# EAGLE design Argo2_Tracker (EAGLE 7.5.0)
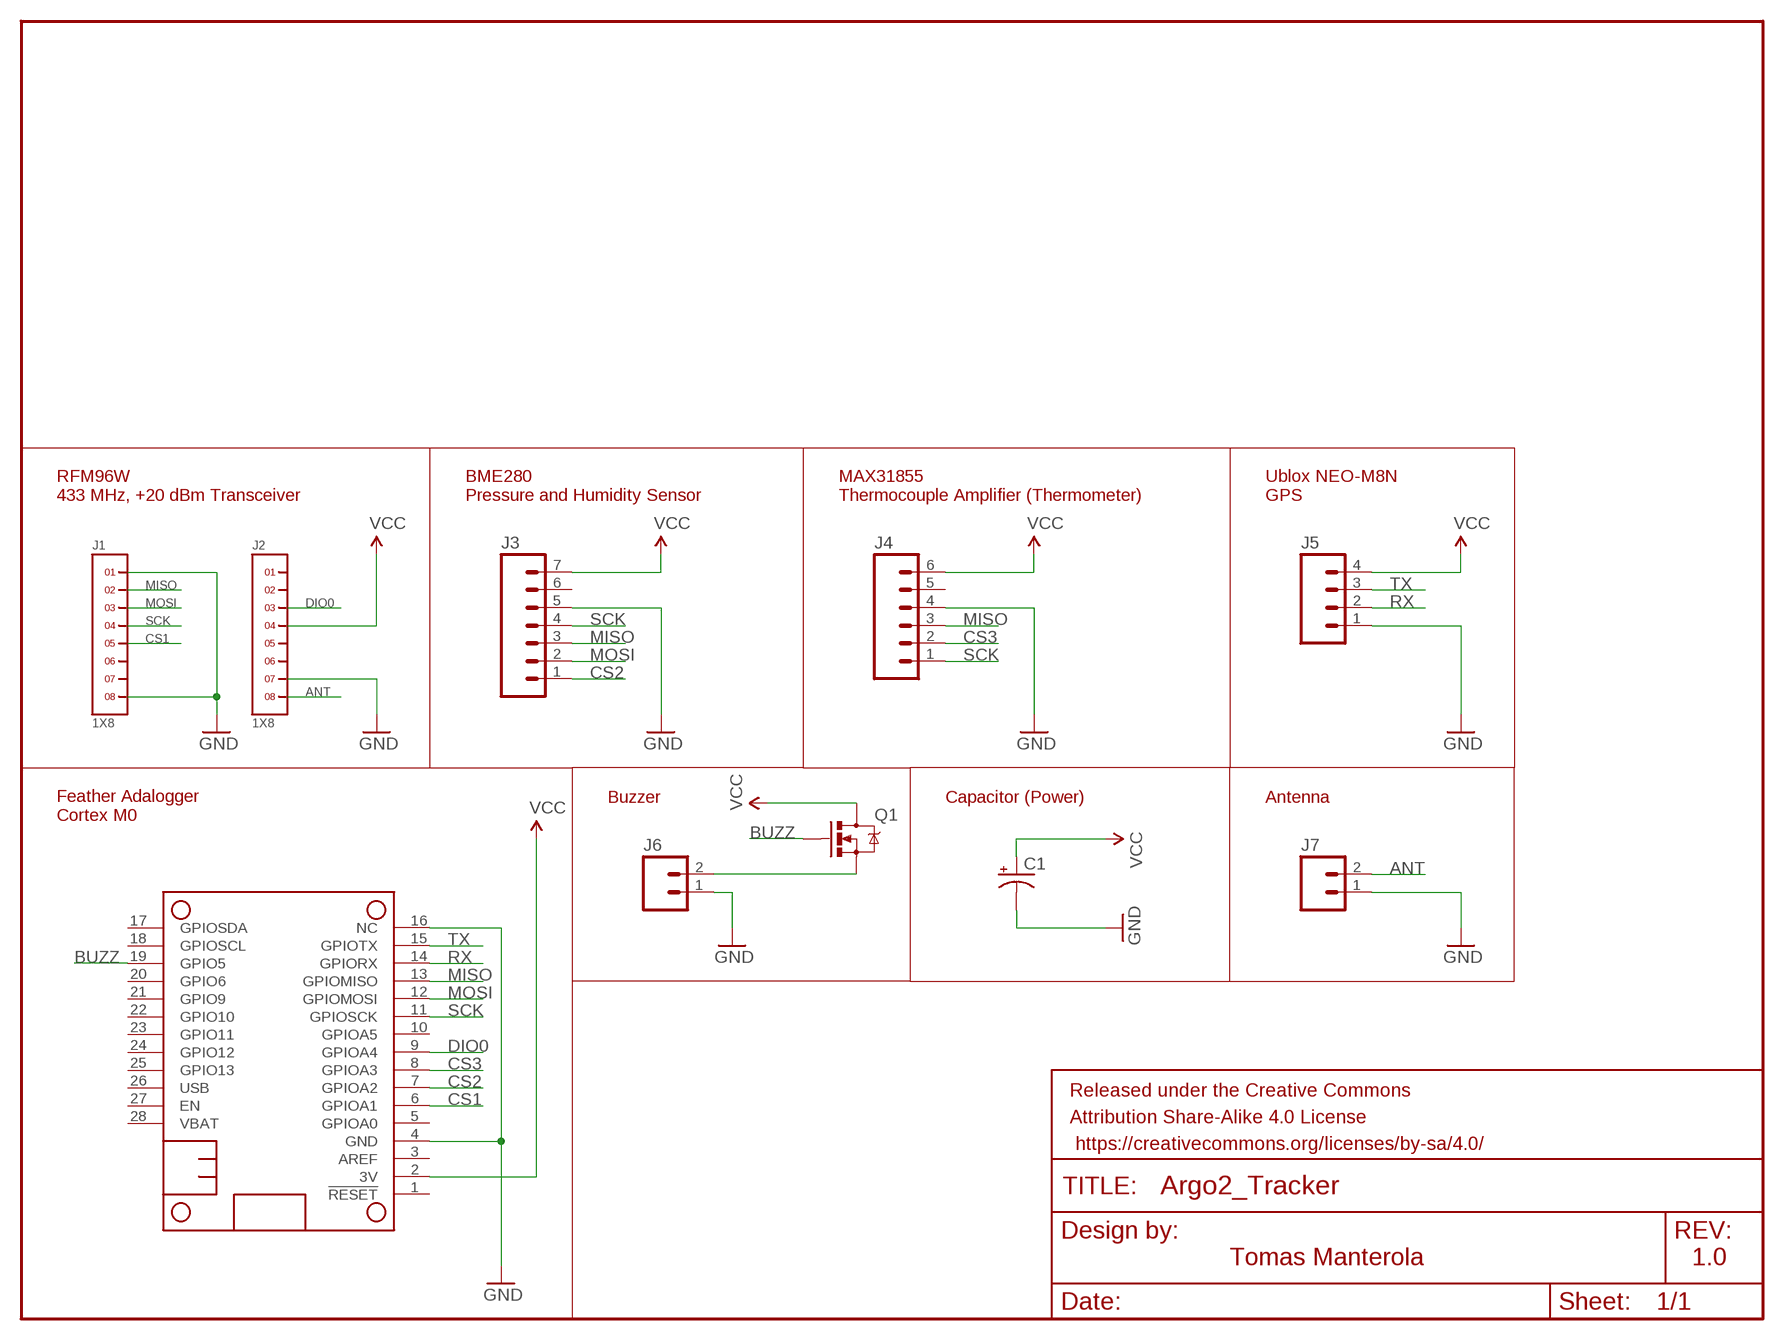
[diagram p0: schematic, sheet 1]

## Parts
C1  CAP_POLPTH4  [CPOL-RADIAL-1000UF-25V]
FRAME1  FRAME-LETTERNO_PACKAGE  [DUMMY]
J1  1X8  [1X8]
J2  1X8  [1X8]
J3  M07  [1X07]
J4  M06SILK_FEMALE_PTH  [1X06]
J5  M041X04_NO_SILK  [1X04_NO_SILK]
J6  M02PTH  [1X02]
J7  M02PTH  [1X02]
MS1  FEATHERWING_NODIM  [FEATHERWING_DIM]
Q1  MOSFET-NCHANNELFQP30N06L  [TO220V]

## Nets
ANT: J2.8 J7.2
BUZZ: MS1.19(GPIO5) Q1.1(G)
CS1: J1.5 MS1.6(GPIOA1)
CS2: J3.1 MS1.7(GPIOA2)
CS3: J4.2 MS1.8(GPIOA3)
DIO0: J2.3 MS1.9(GPIOA4)
GND: C1.2(-) J1.1 J1.8 J2.7 J3.5 J4.4 J5.1 J6.1 J7.1 MS1.4(GND) MS1.16(NC)
MISO: J1.2 J3.3 J4.3 MS1.13(GPIOMISO)
MOSI: J1.3 J3.2 MS1.12(GPIOMOSI)
N$1: J6.2 Q1.3(S)
RX: J5.2 MS1.14(GPIORX)
SCK: J1.4 J3.4 J4.1 MS1.11(GPIOSCK)
TX: J5.3 MS1.15(GPIOTX)
VCC: C1.1(+) J2.4 J3.7 J4.6 J5.4 MS1.2(3V) Q1.2(D)
Unconnected: J1.6 J1.7 J2.1 J2.2 J2.5 J2.6 J3.6 J4.5 MS1.1(!RESET) MS1.3(AREF) MS1.5(GPIOA0) MS1.10(GPIOA5) MS1.17(GPIOSDA) MS1.18(GPIOSCL) MS1.20(GPIO6) MS1.21(GPIO9) MS1.22(GPIO10) MS1.23(GPIO11) MS1.24(GPIO12) MS1.25(GPIO13) MS1.26(USB) MS1.27(EN) MS1.28(VBAT)

## Notes on the sheet
- RFM96W
  433 MHz, +20 dBm Transceiver
- BME280
  Pressure and Humidity Sensor
- MAX31855
  Thermocouple Amplifier (Thermometer)
- Ublox NEO-M8N
  GPS
- Buzzer | Capacitor (Power) | Antenna
- Feather Adalogger
  Cortex M0
- Tomas Manterola | 1.0

## Library data of the parts
C1 = SparkFun-Passives:CAP_POL: Capacitor Polarized These are standard SMD and PTH capacitors. Normally 10uF, 47uF, and 100uF in electrolytic and tantalum varieties. Always verify the external diameter of the through hole cap, it varies with capacity, voltage, and manufacturer. The EIA devices should be standard.
FRAME1 = SparkFun-Aesthetics:FRAME-LETTER: Schematic Frame Standard 8.5x11 US Letter frame; DESIGNER: Tomas Manterola; VERSION: 1.0
J1 J2 = headers(2mm):1X8
J3 = SparkFun-Connectors:M07: Header 7 Standard 7-pin 0.1" header. Use with straight break away headers (SKU : PRT-00116), right angle break away headers (PRT-00553), swiss pins (PRT-00743), machine pins (PRT-00117), and female headers (PRT-00115). NOTES ON THE VARIANTS LOCK and LOCK_LONGPADS... This footprint was designed to help hold the alignment of a through-hole component (i.e. 7-pin header) while soldering it into place. You may notice that each hole has been shifted either up or down by 0.005 of an inch from it's more standard position (which is usually a perfectly straight line). This slight alteration caused the pins (the squares in the middle) to touch the edges of the holes. Because they are alternating, it causes a "brace" to hold the header in place. 0.005 has proven to be the perfect amount of "off-center" position when using our standard breakaway headers. Although looks a little odd when you look at the bare footprint, once you have a header in there, the alteration is very hard to notice. Also, if you push a header all the way into place, it is covered up entirely on the bottom side. This idea of altering the position of holes to aid alignment will be further integrated into the Sparkfun Library for other footprints. It can help hold any component with 3 or more connection pins.
J4 = SparkFun-Connectors:M06: Header 6 Standard 6-pin 0.1" header. Use with straight break away headers (SKU : PRT-00116), right angle break away headers (PRT-00553), swiss pins (PRT-00743), machine pins (PRT-00117), and female headers (PRT-00115). Molex polarized connector foot print use with SKU : PRT-08094 with associated crimp pins and housings. NOTES ON THE VARIANTS LOCK and LOCK_LONGPADS... This footprint was designed to help hold the alignment of a through-hole component (i.e. 6-pin header) while soldering it into place. You may notice that each hole has been shifted either up or down by 0.005 of an inch from it's more standard position (which is a perfectly straight line). This slight alteration caused the pins (the squares in the middle) to touch the edges of the holes. Because they are alternating, it causes a "brace" to hold the component in place. 0.005 has proven to be the perfect amount of "off-center" position when using our standard breakaway headers. Although looks a little odd when you look at the bare footprint, once you have a header in there, the alteration is very hard to notice. Also,if you push a header all the way into place, it is covered up entirely on the bottom side. This idea of altering the position of holes to aid alignment will be further integrated into the Sparkfun Library for other footprints. It can help hold any component with 3 or more connection pins.; PROD_ID: CONN-08437
J5 = SparkFun-Connectors:M04: Header 4 Standard 4-pin 0.1" header. Use with straight break away headers (SKU : PRT-00116), right angle break away headers (PRT-00553), swiss pins (PRT-00743), machine pins (PRT-00117), and female headers (PRT-00115). Molex polarized connector foot print use with SKU : PRT-08231 with associated crimp pins and housings. 1MM SMD Version SKU: PRT-10208; PROD_ID: CONN-09696
J6 J7 = SparkFun-Connectors:M02: Standard 2-pin 0.1" header. Use with - straight break away headers ( PRT-00116) - right angle break away headers (PRT-00553) - swiss pins (PRT-00743) - machine pins (PRT-00117) - female headers (PRT-00115) Molex polarized connector foot print use with: PRT-08233 with associated crimp pins and housings. 2.54_SCREWTERM for use with PRT-10571. 3.5mm Screw Terminal footprints for PRT-08084 5mm Screw Terminal footprints for use with PRT-08432
MS1 = adafruit:FEATHERWING
Q1 = SparkFun-DiscreteSemi:MOSFET-NCHANNEL: Common NMOSFET Parts MFG P/N Store ID Prod ID FDD8780 TRANS-09984 SI7820DN TRANS-11055 FDS6630A IC-08089 2N7002PW TRANS-11151 FQP30N06L COM-10213 TRANS-10060 BSS123LT1G TRANS-08345 BSS138 TRANS-00830 BS170 2N7000; PROD_ID: TRANS-10060

## Net classes
1 fiftyohm: width 1 mm

## Board
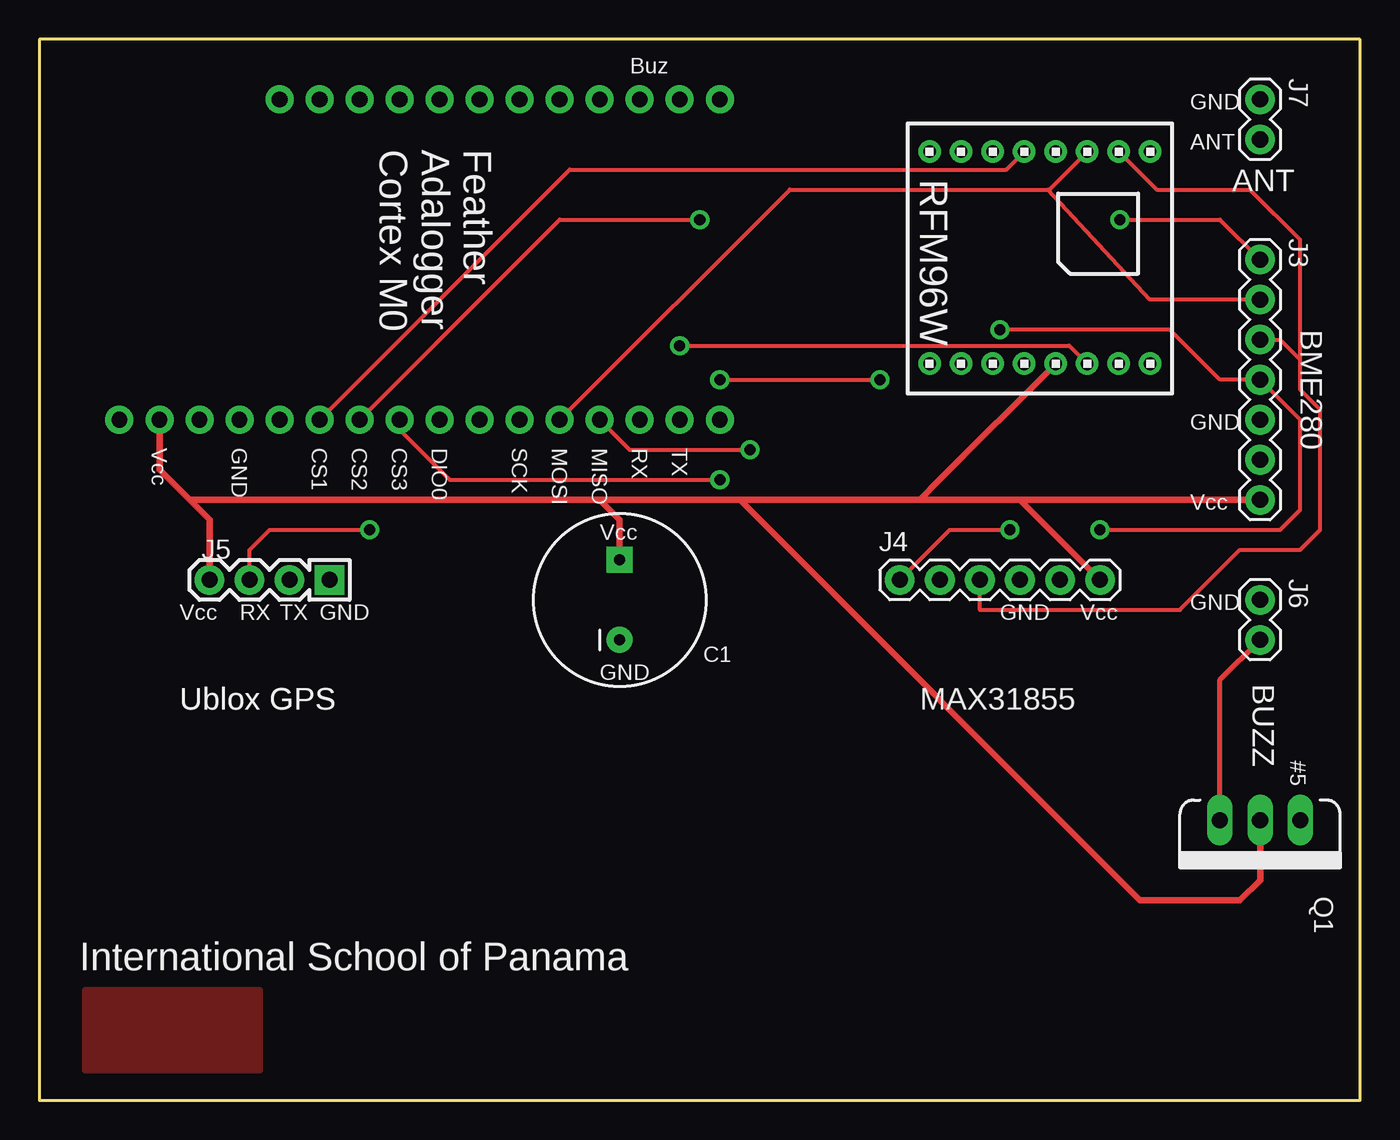
[diagram p1: board, top side]
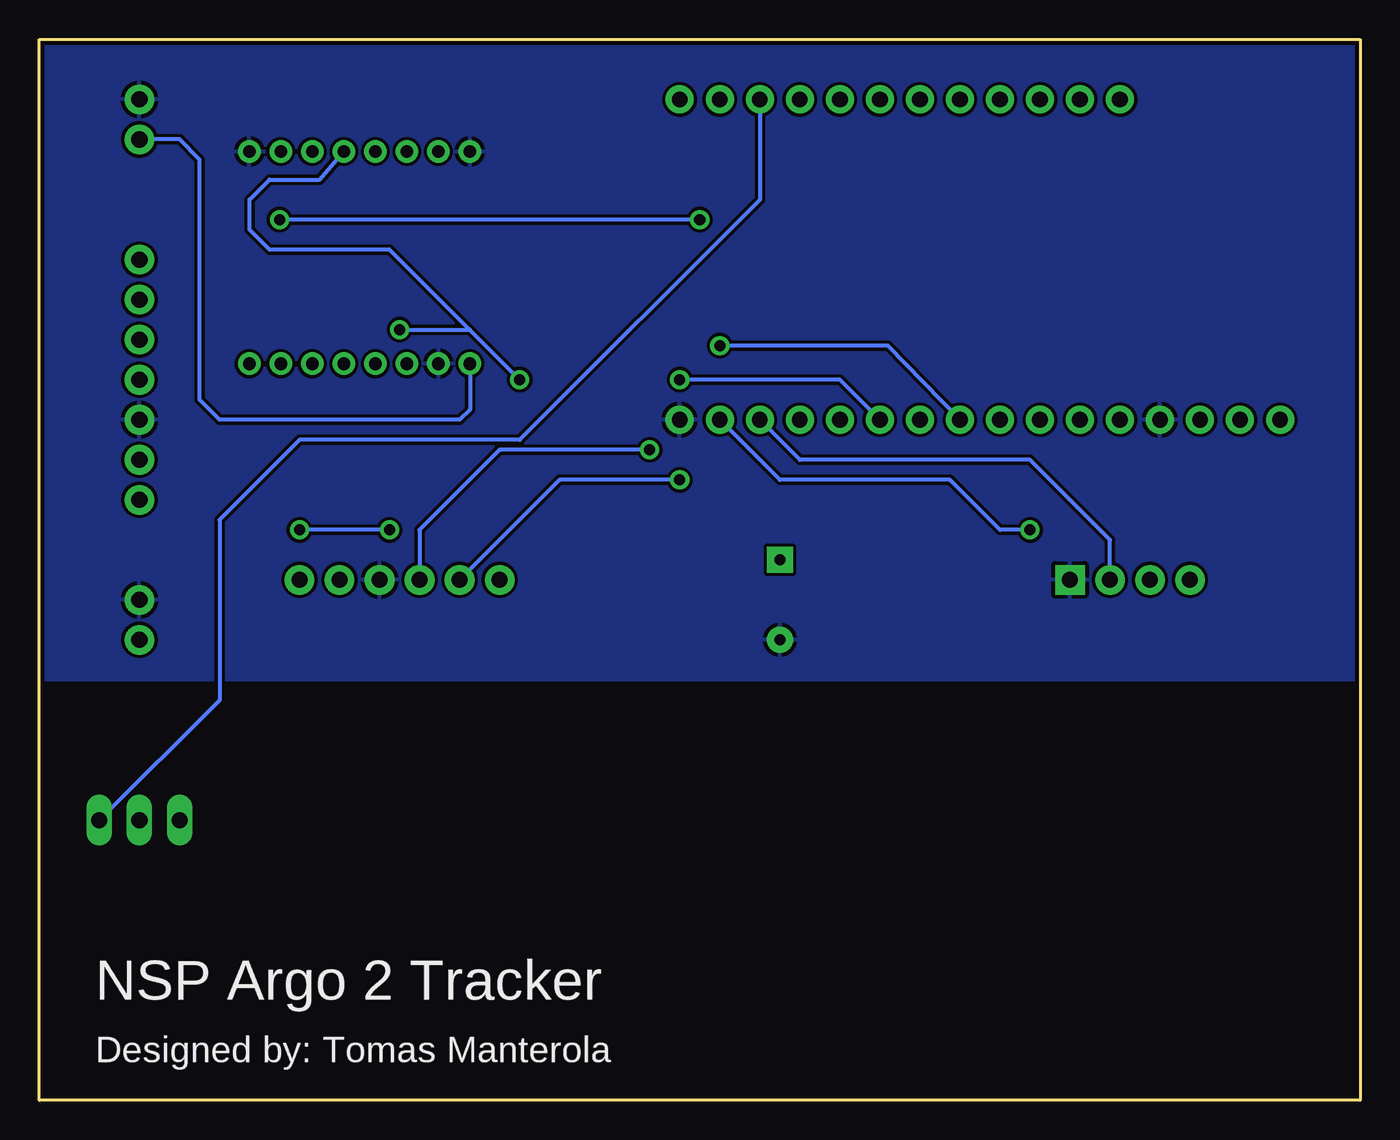
[diagram p2: board, bottom side, seen from below]

Size 83.82 x 67.31 mm. Coordinates in mm from the lower left corner, seen from the top.
Outline: 0,0 83.82,0 83.82,67.31 0,67.31 0,0
Copper layers (1*16): Top 0.035mm / dielectric 1.5mm / Bottom 0.035mm
Design rules "SparkFun": minimum track width 8mil, minimum drill 20mil, track to track 8mil, track to pad 8mil, pad to pad 8mil, via to via 8mil, smd to smd 8mil, copper to edge 10mil, drill to drill 8mil, minimum pad ring 12mil, minimum via ring 10mil, stop-mask expansion 4mil, vias tented up to drill 25mil, thermal gap 10mil

### Footprints (pad centres in the part's own frame; a part is rotated, then mirrored left to right if it is on the bottom)
CPOL-RADIAL-1000UF-25V = drill 0.7 pad 1.651 square: 1 2.54,0 | drill 0.7 pad 1.651: 2 -2.54,0
1X8 = drill 0.8 pad 1.422: 1 -7,0; 2 -5,0; 3 -3,0; 4 -1,0; 5 1,0; 6 3,0; 7 5,0; 8 7,0
1X07 = drill 1.016 pad 1.88: 1 0,0; 2 2.54,0; 3 5.08,0; 4 7.62,0; 5 10.16,0; 6 12.7,0; 7 15.24,0
1X06 = drill 1.016 pad 1.88: 1 0,0; 2 2.54,0; 3 5.08,0; 4 7.62,0; 5 10.16,0; 6 12.7,0
1X04_NO_SILK = drill 1.016 pad 1.88 square: 1 0,0 | drill 1.016 pad 1.88: 2 2.54,0; 3 5.08,0; 4 7.62,0
1X02 = drill 1.016 pad 1.88: 1 0,0; 2 2.54,0
FEATHERWING_DIM = drill 1 pad 1.778: 1 6.35,1.27; 2 8.89,1.27; 3 11.43,1.27; 4 13.97,1.27; 5 16.51,1.27; 6 19.05,1.27; 7 21.59,1.27; 8 24.13,1.27; 9 26.67,1.27; 10 29.21,1.27; 11 31.75,1.27; 12 34.29,1.27; 13 36.83,1.27; 14 39.37,1.27; 15 41.91,1.27; 16 44.45,1.27; 17 44.45,21.59; 18 41.91,21.59; 19 39.37,21.59; 20 36.83,21.59; 21 34.29,21.59; 22 31.75,21.59; 23 29.21,21.59; 24 26.67,21.59; 25 24.13,21.59; 26 21.59,21.59; 27 19.05,21.59; 28 16.51,21.59
TO220V = drill 1.016 long: 1 -2.54,0; 2 0,0; 3 2.54,0

### Placement (x,y rotation side)
C1  36.83,31.75 90 top
FRAME1  -1.91,14.61 0 top
J1  63.5,60.2 180 top
J2  63.5,46.74 180 top
J3  77.47,53.34 270 top
J4  54.61,33.02 0 top
J5  18.41,33.02 180 top
J6  77.47,31.75 270 top
J7  77.47,63.5 270 top
MS1  -1.27,41.91 0 top
Q1  77.47,17.78 180 top

### Tracks (layer width: path | path; a pad name or v marks a point on that pad's centre or on a via)
ANT
  Bottom 0.254: J2.8 56.5,43.83 57.15,43.18 72.39,43.18 73.66,44.45 73.66,59.69 74.93,60.96 J7.2
BUZZ
  Bottom 0.254: MS1.19 38.1,57.15 53.34,41.91 67.31,41.91 72.39,36.83 72.39,25.4 Q1.1
CS1
  Top 0.254: MS1.6 33.66,59.05 61.36,59.05 J1.5
CS2  (via drill 0.7)
  Top 0.254: MS1.7 33.02,55.88 v41.91,55.88 | v68.58,55.88 74.93,55.88 J3.1
  Bottom 0.254: v41.91,55.88 v68.58,55.88
CS3  (via drill 0.7)
  Top 0.254: MS1.8 22.86,42.55 26.04,39.37 v43.18,39.37
  Bottom 0.254: v43.18,39.37 50.8,39.37 J4.2
DIO0  (via drill 0.7)
  Top 0.254: v40.64,47.88 65.36,47.88 J2.3
  Bottom 0.254: MS1.9 29.97,47.88 v40.64,47.88
GND
  pour Bottom: 0,67.31 83.82,67.31 83.82,26.67 0,26.67
MISO  (via drill 0.7)
  Top 0.254: MS1.13 37.47,41.27 v45.09,41.27 | J4.3 59.69,31.11 72.39,31.11 76.2,34.92 80.01,34.92 81.28,36.2 81.28,43.81 80.01,45.09 80.01,46.99 | 80.01,46.99 80.01,54.61 76.83,57.78 70.91,57.78 J1.2 | J3.3 78.74,48.26 80.01,46.99
  Bottom 0.254: J4.3 59.69,36.2 54.61,41.27 v45.09,41.27
MOSI
  Top 0.254: MS1.12 47.62,57.78 64.01,57.78 | J3.2 70.48,50.8 64.01,57.78 | 64.01,57.78 64.09,57.78 J1.3
N$1
  Top 0.305: Q1.3 74.93,26.67 J6.2
N$2
  pour Top: 2.9,6.99 13.97,6.99 13.97,1.91 2.9,1.91
RX
  Bottom 0.254: MS1.14 35.56,40.64 20.95,40.64 15.88,35.56 J5.2
SCK  (via drill 0.7)
  Top 0.254: v43.18,45.72 v53.34,45.72 | v60.96,48.9 71.75,48.9 74.93,45.72 J3.4 80.01,43.18 80.01,37.47 78.74,36.2 v67.31,36.2 | J4.1 57.78,36.2 v61.59,36.2
  Bottom 0.254: MS1.11 33.02,45.72 v43.18,45.72 | J1.4 66.02,58.42 69.22,58.42 70.48,57.15 70.48,55.24 69.22,53.98 61.59,53.98 56.52,48.9 | v53.34,45.72 56.52,48.9 | v60.96,48.9 56.52,48.9 | v61.59,36.2 v67.31,36.2
TX  (via drill 0.7)
  Top 0.254: J5.3 13.34,34.92 14.61,36.2 v20.95,36.2
  Bottom 0.254: MS1.15 36.83,39.37 26.04,39.37 22.86,36.2 v20.95,36.2
VCC
  Top 0.406: MS1.2 7.62,40.01 9.53,38.1 | J3.7 62.23,38.1 | 55.88,38.1 44.45,38.1 | 44.45,38.1 35.56,38.1 | 35.56,38.1 9.53,38.1 | J5.4 10.79,36.83 9.53,38.1 | 55.88,38.1 57.13,39.37 J2.4 | 55.88,38.1 62.23,38.1 | 62.23,38.1 J4.6 | Q1.2 77.47,13.97 76.2,12.7 69.85,12.7 44.45,38.1 | C1.1 36.83,36.83 35.56,38.1

### Text on the board
tPlace: Buz | GND | Feather / Adalogger / Cortex M0 | ANT | RFM96W | ANT | BME280 | GND | Vcc | GND | CS1 | CS2 | CS3 | DIO0 | SCK | MOSI | MISO | RX | TX | Vcc | Vcc | GND | Vcc | RX | TX | GND | GND | Vcc | GND | BUZZ | Ublox GPS | Ublox GPS | MAX31855 | #5 | International School of Panama
bPlace: NSP Argo 2 Tracker | Designed by: Tomas Manterola
tStop: Argo 2